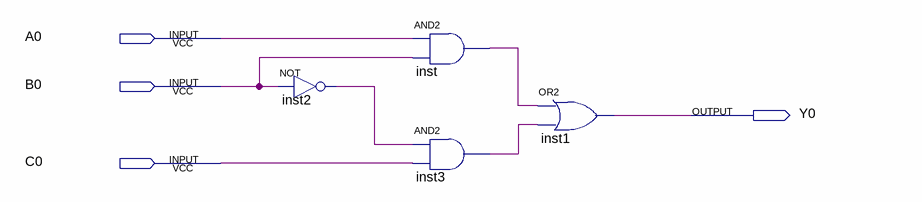
[diagram p0: schematic sheet]
// Quartus schematic Mux_2to1.bdf as structural Verilog: 4 symbols, 4 pins
module Mux_2to1 (
  input  A0,
  input  B0,
  input  C0,
  output Y0
);

  wire inst2_out, inst3_out, inst_out;

  not inst2 (inst2_out, B0);
  and inst (inst_out, A0, B0);
  and inst3 (inst3_out, inst2_out, C0);
  or inst1 (Y0, inst_out, inst3_out);
endmodule
